# Altium schematic sheet TERMOMETRO-Martinez.SchDoc
size A4
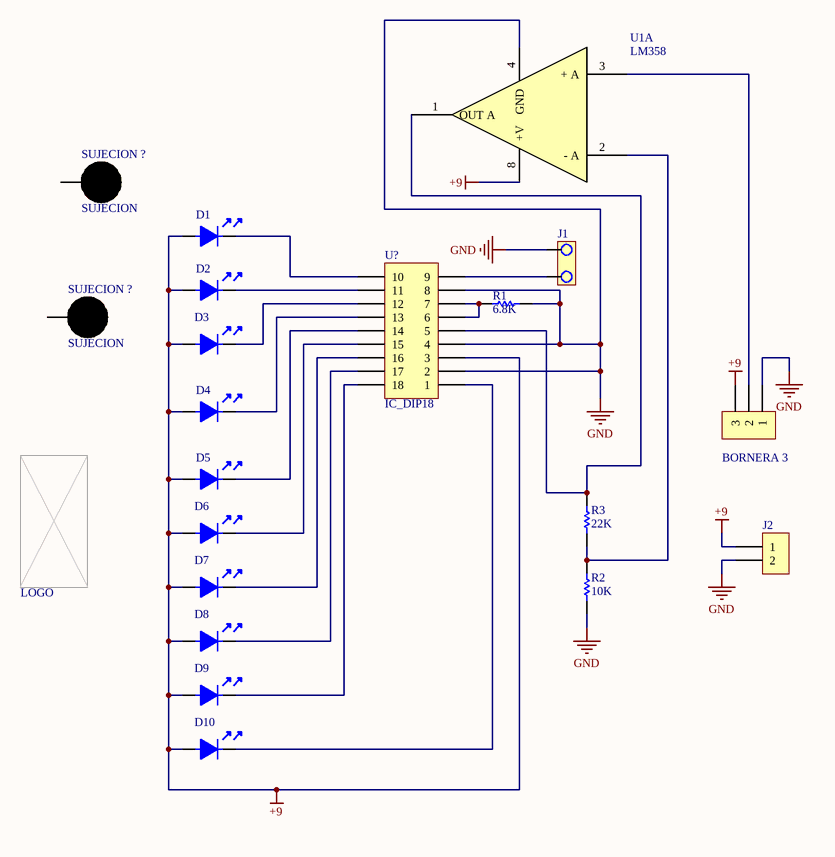
[diagram p0: TERMOMETRO-Martinez.SchDoc]

## Parts
(Parts that share a designator on the sheet are numbered #1, #2 ... from top to bottom, then left to right.)
?#1  BORNERA 3  [BORNERA3]
?#2  LOGO  [LOGO]
D1  (no value)  [LED3]
D2  (no value)  [LED3]
D3  (no value)  [LED3]
D4  (no value)  [LED3]
D5  (no value)  [LED3]
D6  (no value)  [LED3]
D7  (no value)  [LED3]
D8  (no value)  [LED3]
D9  (no value)  [LED3]
D10  (no value)  [LED3]
J1  (no value)  [JUMPER2]
J2  (no value)  [BORNERA2]
R1  6.8K  [RES400]
R2  10K  [RES400]
R3  22K  [RES400]
SUJECION_?#1  SUJECION  [SUJECION (5.00MM - 3.50MM)]
SUJECION_?#2  SUJECION  [SUJECION (5.00MM - 3.50MM)]
U1  LM358  [DIP8]  (part A of 2)
U?  IC_DIP18  [DIP18]

## Nets
+9: ?#1.3 D1.1 D2.1 D3.1 D4.1 D5.1 D6.1 D7.1 D8.1 D9.1 D10.1 J2.1 U1.8(+V) U?.3
GND: ?#1.1 J1.2 J2.2 R1.2 R2.1 U1.4(GND) U?.2 U?.4 U?.8
Net?#1_2: ?#1.2 U1.3(+_A)
NetD1_2: D1.2 U?.10
NetD2_2: D2.2 U?.11
NetD3_2: D3.2 U?.12
NetD4_2: D4.2 U?.13
NetD5_2: D5.2 U?.14
NetD6_2: D6.2 U?.15
NetD7_2: D7.2 U?.16
NetD8_2: D8.2 U?.17
NetD9_2: D9.2 U?.18
NetD10_2: D10.2 U?.1
NetJ1_1: J1.1 U?.9
NetR1_1: R1.1 U?.6 U?.7
NetR2_2: R2.2 R3.1 U1.2(-_A)
NetR3_2: R3.2 U1.1(OUT_A) U?.5

Not connected (* = marked no-connect by the designer): SUJECION_?#1 1; SUJECION_?#2 1

## Library data of the parts
D1-D10 = LED
J1 = JUMPER
J2 = BORNERA 2
R1-R3 = RES